# EAGLE design R2D2 Remote (EAGLE 9.5.2)
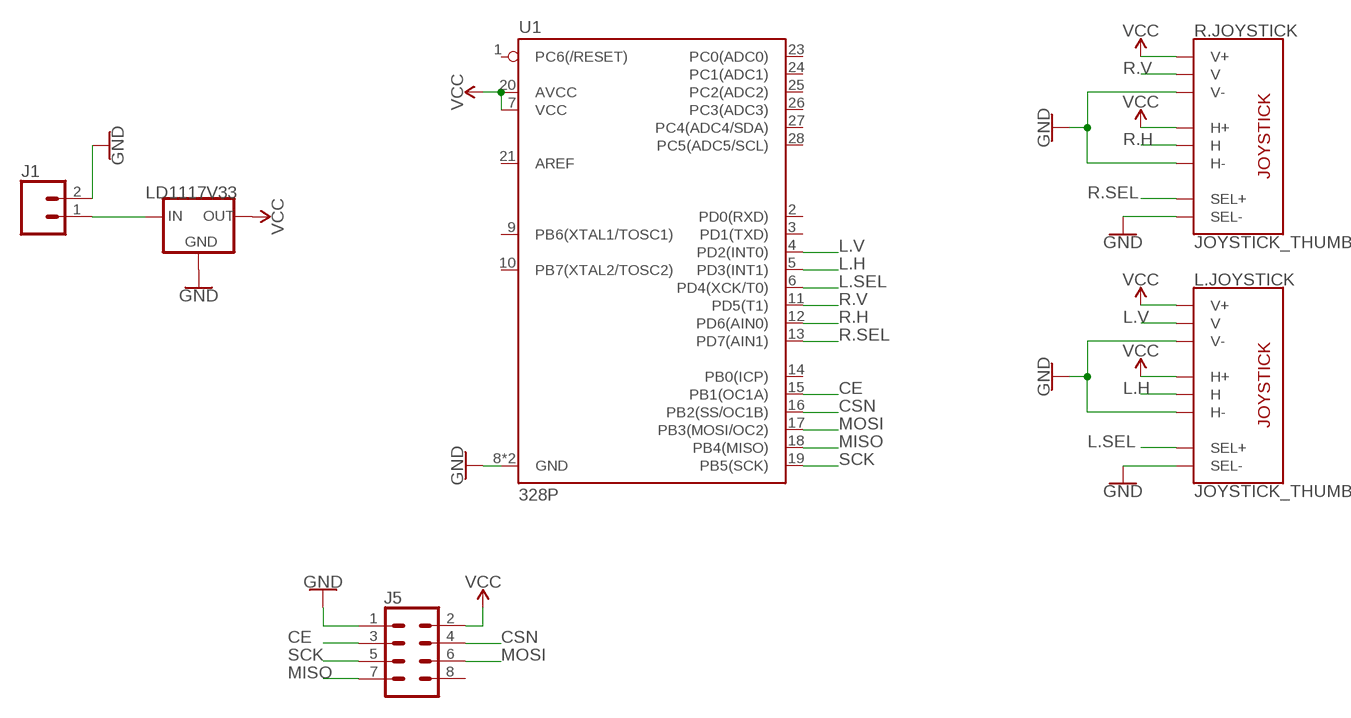
[diagram p0: schematic, sheet 1]

## Parts
J1  CONN_02  [1X02]
J5  CONN_04X2  [2X4]
L.JOYSTICK  JOYSTICK_THUMB  [JOYSTICK]
R.JOYSTICK  JOYSTICK_THUMB  [JOYSTICK]
U1  328P  ATMEGA328P_PDIP  [DIP28]
U$1  LD1117V33  V_REG_LD1117VXX  [78XXL]

## Nets
CE: J5.3 U1.15(PB1(OC1A))
CSN: J5.4 U1.16(PB2(SS/OC1B))
GND: J1.2 J5.1 L.JOYSTICK.B2A(SEL-) L.JOYSTICK.H3(H-) L.JOYSTICK.V3(V-) R.JOYSTICK.B2A(SEL-) R.JOYSTICK.H3(H-) R.JOYSTICK.V3(V-) U1.8(GND) U1.22(GND) U$1.IN(GND)
L.H: L.JOYSTICK.H2(H) U1.5(PD3(INT1))
L.SEL: L.JOYSTICK.B1A(SEL+) U1.6(PD4(XCK/T0))
L.V: L.JOYSTICK.V2(V) U1.4(PD2(INT0))
MISO: J5.7 U1.18(PB4(MISO))
MOSI: J5.6 U1.17(PB3(MOSI/OC2))
N$1: J1.1 U$1.OUT(IN)
R.H: R.JOYSTICK.H2(H) U1.12(PD6(AIN0))
R.SEL: R.JOYSTICK.B1A(SEL+) U1.13(PD7(AIN1))
R.V: R.JOYSTICK.V2(V) U1.11(PD5(T1))
SCK: J5.5 U1.19(PB5(SCK))
VCC: J5.2 L.JOYSTICK.H1(H+) L.JOYSTICK.V1(V+) R.JOYSTICK.H1(H+) R.JOYSTICK.V1(V+) U1.7(VCC) U1.20(AVCC) U$1.GND(OUT)
Unconnected: J5.8 U1.1(PC6(/RESET)) U1.2(PD0(RXD)) U1.3(PD1(TXD)) U1.9(PB6(XTAL1/TOSC1)) U1.10(PB7(XTAL2/TOSC2)) U1.14(PB0(ICP)) U1.21(AREF) U1.23(PC0(ADC0)) U1.24(PC1(ADC1)) U1.25(PC2(ADC2)) U1.26(PC3(ADC3)) U1.27(PC4(ADC4/SDA)) U1.28(PC5(ADC5/SCL))

## Library data of the parts
J1 = SparkFun-Connectors:CONN_02: Multi connection point. Often used as Generic Header-pin footprint for 0.1 inch spaced/style header connections On any of the 0.1 inch spaced packages, you can populate with these: Break Away Headers - Straight <https://www.sparkfun.com/products/116> (PRT-00116) Break Away Male Headers - Right Angle <https://www.sparkfun.com/products/553> (PRT-00553) Female Headers <https://www.sparkfun.com/products/115> (PRT-00115) Break Away Headers - Machine Pin <https://www.sparkfun.com/products/117> (PRT-00117) Break Away Female Headers - Swiss Machine Pin <https://www.sparkfun.com/products/743> (PRT-00743) For SCREWTERMINALS and SPRING TERMINALS visit here: Screw Terimnals on SparkFun.com <https://www.sparkfun.com/search/results?term=Screw+Terminals> (5mm/3.5mm/2.54mm spacing) This device is also useful as a general connection point to wire up your design to another part of your project. Our various solder wires solder well into these plated through hole pads. Hook-Up Wire - Assortment (Stranded, 22 AWG) <https://www.sparkfun.com/products/11375> (PRT-11375) Hook-Up Wire - Assortment (Solid Core, 22 AWG) <https://www.sparkfun.com/products/11367> (PRT-11367) View the entire wire category on our website here <https://www.sparkfun.com/categories/141> Special notes: Molex polarized connector foot print use with: PRT-08233 with associated crimp pins and housings. 2.54_SCREWTERM for use with PRT-10571. 3.5mm Screw Terminal footprints for PRT-08084 5mm Screw Terminal footprints for use with PRT-08432
J5 = SparkFun-Connectors:CONN_04X2: Multi connection point. Often used as Generic Header-pin footprint for 0.1 inch spaced/style header connections On any of the 0.1 inch spaced packages, you can populate with these: Break Away Headers - Straight <https://www.sparkfun.com/products/116> (PRT-00116) Break Away Male Headers - Right Angle <https://www.sparkfun.com/products/553> (PRT-00553) Female Headers <https://www.sparkfun.com/products/115> (PRT-00115) Break Away Headers - Machine Pin <https://www.sparkfun.com/products/117> (PRT-00117) Break Away Female Headers - Swiss Machine Pin <https://www.sparkfun.com/products/743> (PRT-00743)
L.JOYSTICK R.JOYSTICK = SparkFun-Switches:JOYSTICK_THUMB: Analog Thumb Joystick This is a joystick very similar to the ‘analog’ joysticks on PS2 (PlayStation 2) controllers. Directional movements are simply two potentiometers - one for each axis. Pots are ~10k each. This joystick also has a select button that is actuated when the joystick is pressed down. SparkFun Products Thumb Joystick <https://www.sparkfun.com/products/9032> (COM-09032) SparkFun Thumb Joystick Breakout <https://www.sparkfun.com/products/9110> (BOB-09110) SparkFun Joystick Shield Kit <https://www.sparkfun.com/products/9760> (DEV-09760); PROD_ID: COMP-09744; SF_SKU: COM-09032
U1 = SparkFun-IC-Microcontroller:ATMEGA328P_PDIP: Atmel 328P Through hole ATMEGA328P uC used in the Arduino 32kb flash, 1k EEPROM, 2k SRAM Datasheet <http://www.sparkfun.com/datasheets/Components/SMD/ATMega328.pdf> SparkFun Products Storefront component: AVR 28 Pin 20MHz 32K 6A/D - ATMega328P <https://www.sparkfun.com/products/9061> (COM-09061) SparkFun Simon Says - Through-Hole Soldering Kit <https://www.sparkfun.com/products/10547> (KIT-10547) SparkFun Learn to Solder - Simon Says <https://www.sparkfun.com/products/13708> (KIT-13708) SparkFun BigTime Watch Kit <https://www.sparkfun.com/products/11734> (KIT-11734) SparkFun ClockIt <https://www.sparkfun.com/products/10930> (KIT-10930) SparkFun Serial Enabled LCD Kit <https://www.sparkfun.com/products/10097> (LCD-10097) SparkFun Simon Tilts - Through Hole Soldering Kit <https://www.sparkfun.com/products/12634> (KIT-12634) SparkFun Frequency Counter Kit <https://www.sparkfun.com/products/10140> (KIT-10140) FabFM Radio Kit <https://www.sparkfun.com/products/11043> (KIT-11043) SparkFun Binary Blaster Kit <https://www.sparkfun.com/products/12037> (KIT-12037) SparkFun Metro-Gnome <https://www.sparkfun.com/products/9236> (KIT-09236) ATmega328 with Arduino Optiboot (Uno) <https://www.sparkfun.com/products/10524> (DEV-10524); PROD_ID: IC-09136
U$1 = SparkFun-IC-Power:V_REG_LD1117VXX: LD1117VXX voltage regulator. We carry the 3.3V version (COM-00526) in TO-220 package.

## Board
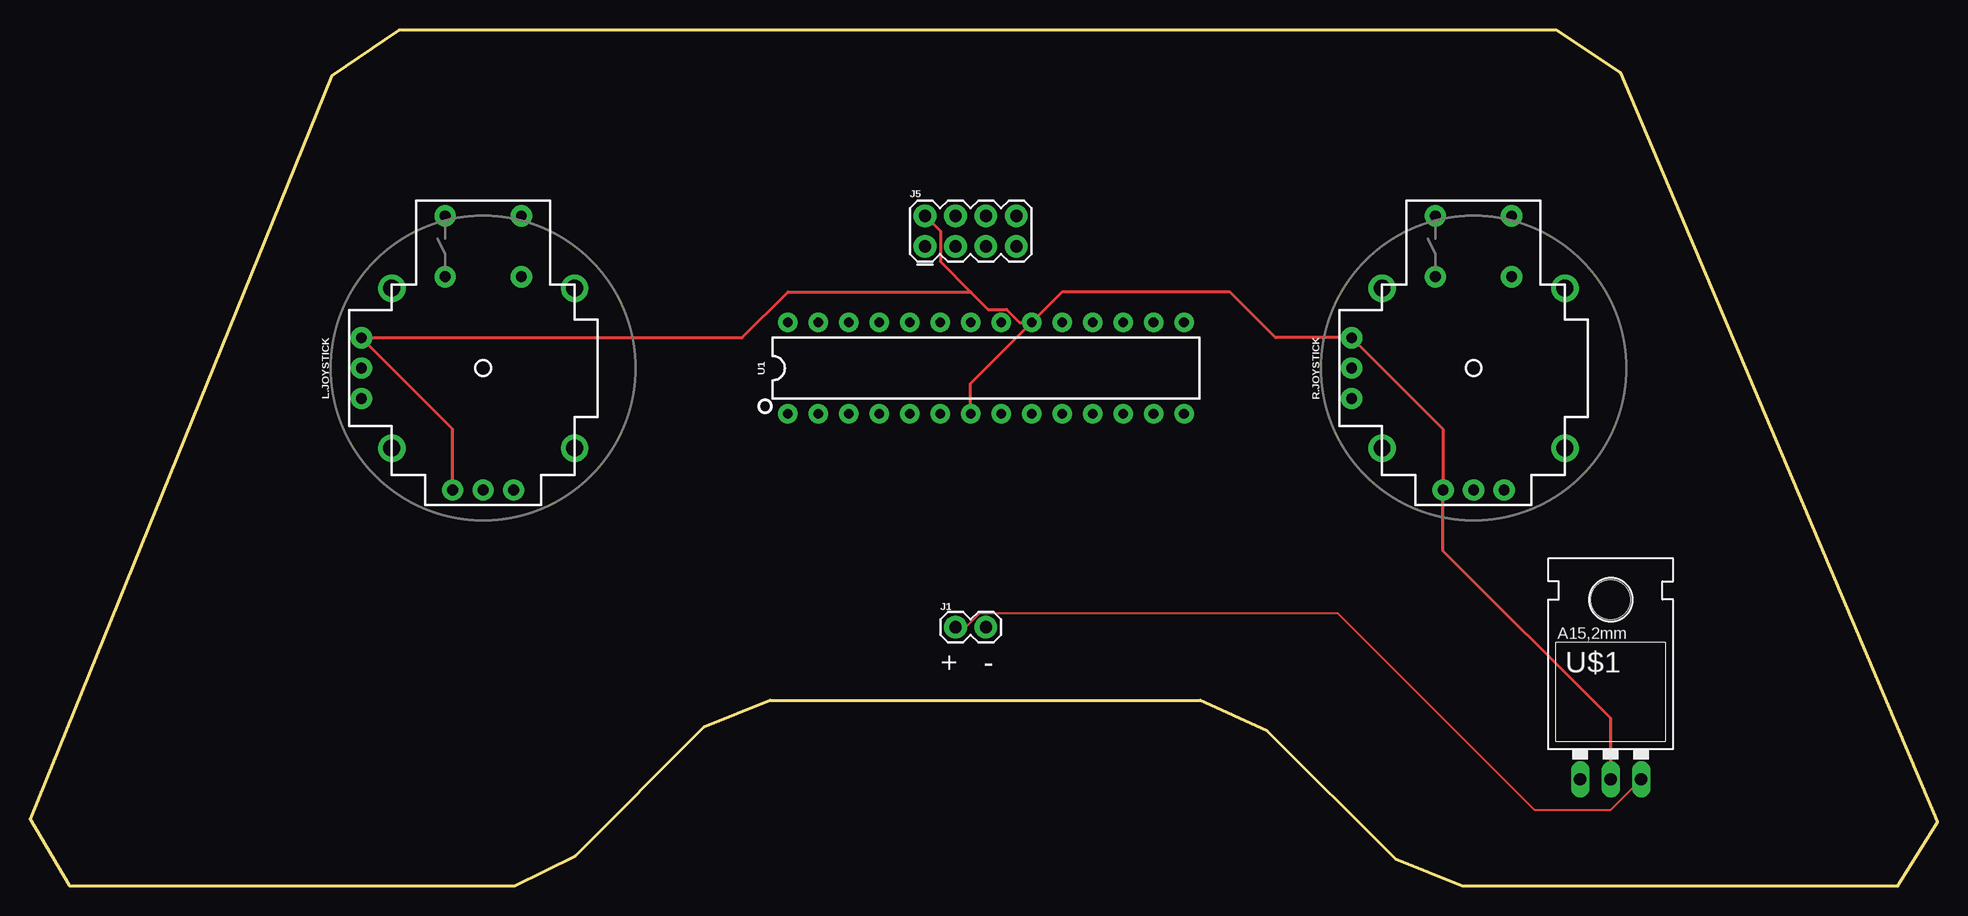
[diagram p1: board, top side]
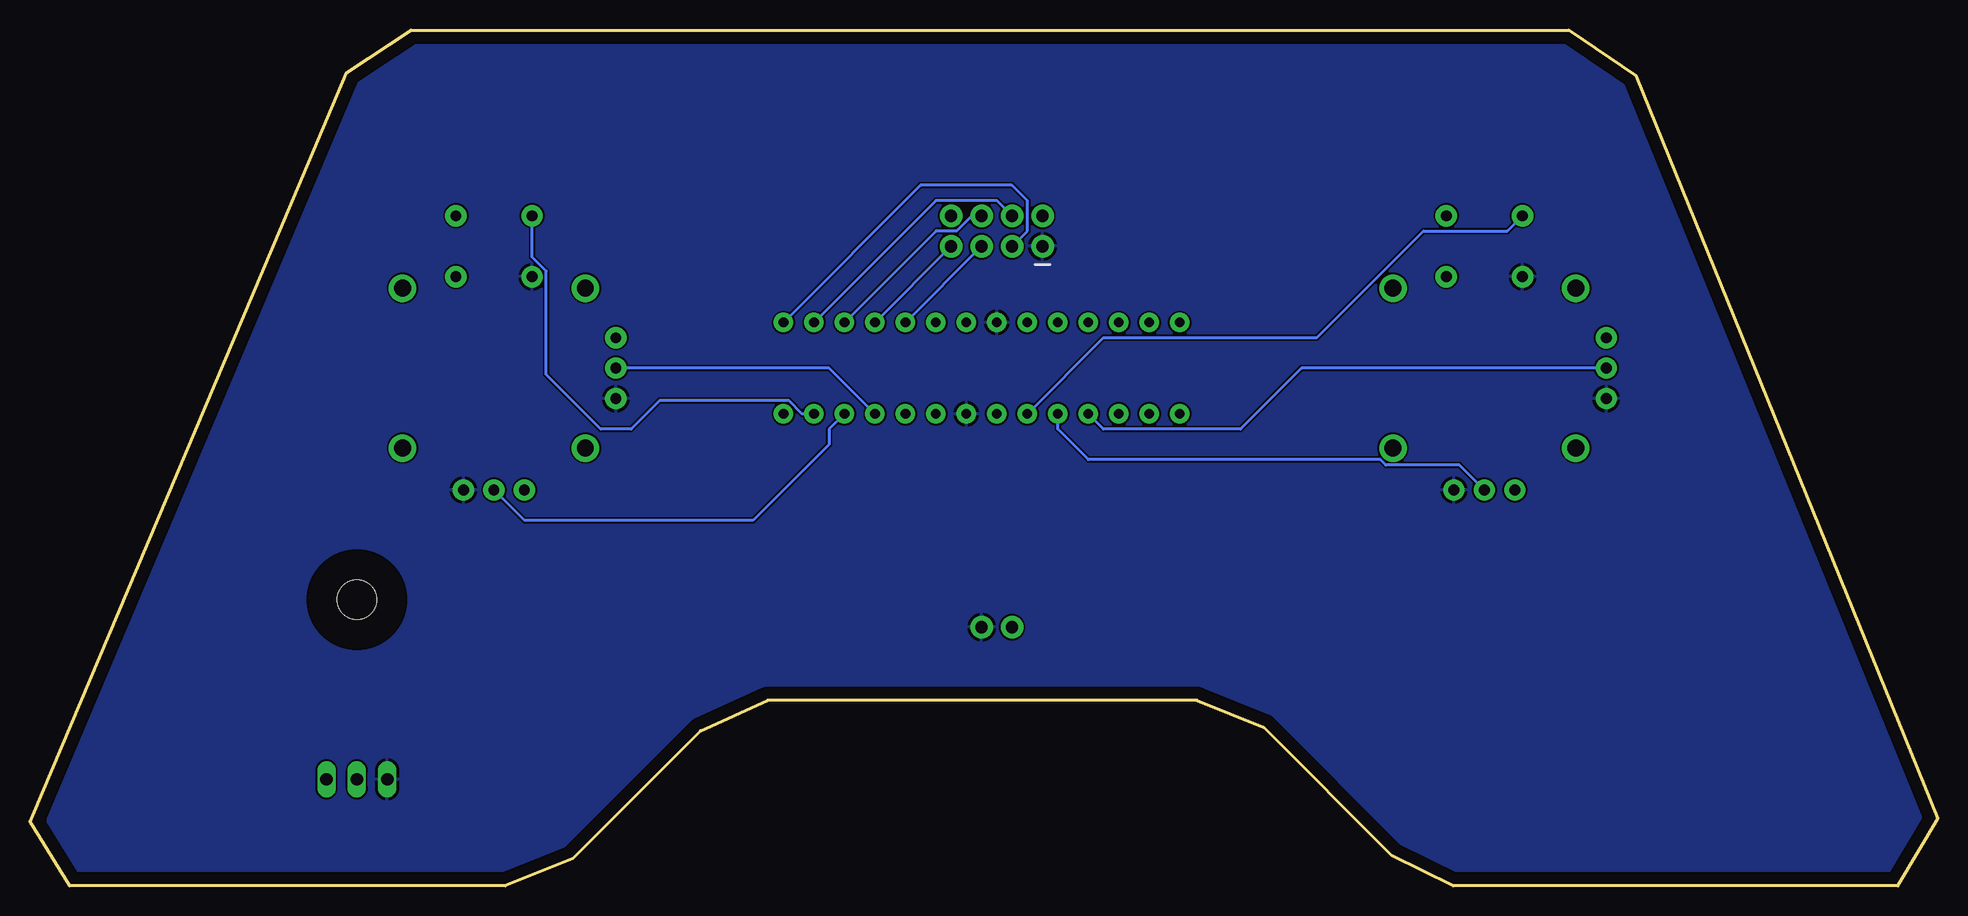
[diagram p2: board, bottom side, seen from below]

Size 159 x 71.37 mm. Coordinates in mm from the lower left corner, seen from the top.
Outline: 3.3,0 40.39,0 45.47,2.54 56.13,13.21 61.72,15.49 97.54,15.49 103.12,12.95 113.79,2.29 119.38,0 155.7,0 159,5.33 132.59,67.82 127.25,71.37 30.73,71.37 25.15,67.56 0,5.59 3.3,0
Copper layers (1*16): Top 0.035mm / dielectric 1.5mm / Bottom 0.035mm
Design rules "default": minimum track width 6mil, minimum drill 0.35mm, track to track 6mil, track to pad 6mil, pad to pad 6mil, via to via 6mil, smd to smd 6mil, copper to edge 40mil, drill to drill 6mil, minimum pad ring 10mil, minimum via ring 8mil, stop-mask expansion 4mil, vias tented up to drill 0mil, thermal gap 10mil

### Footprints (pad centres in the part's own frame; a part is rotated, then mirrored left to right if it is on the bottom)
1X02 = drill 1.016 pad 1.88: 1 0,0; 2 2.54,0
2X4 = drill 1.016 pad 1.88: 1 -3.81,-1.27; 2 -3.81,1.27; 3 -1.27,-1.27; 4 -1.27,1.27; 5 1.27,-1.27; 6 1.27,1.27; 7 3.81,-1.27; 8 3.81,1.27
JOYSTICK = drill 0.9 pad 1.778: B1A -3.175,12.7; B1B 3.175,12.7; B2A -3.175,7.62; B2B 3.175,7.62 | drill 0.889 pad 1.778: H1 -2.54,-10.16; H2 0,-10.16; H3 2.54,-10.16; V1 -10.16,2.54; V2 -10.16,0; V3 -10.16,-2.54 | drill 1.397 pad 2.286: MOUNT1 -7.62,6.668; MOUNT2 -7.62,-6.668; MOUNT3 7.62,-6.668; MOUNT4 7.62,6.668
DIP28 = drill 0.813 pad 1.626: 1 -16.51,-3.81; 2 -13.97,-3.81; 3 -11.43,-3.81; 4 -8.89,-3.81; 5 -6.35,-3.81; 6 -3.81,-3.81; 7 -1.27,-3.81; 8 1.27,-3.81; 9 3.81,-3.81; 10 6.35,-3.81; 11 8.89,-3.81; 12 11.43,-3.81; 13 13.97,-3.81; 14 16.51,-3.81; 15 16.51,3.81; 16 13.97,3.81; 17 11.43,3.81; 18 8.89,3.81; 19 6.35,3.81; 20 3.81,3.81; 21 1.27,3.81; 22 -1.27,3.81; 23 -3.81,3.81; 24 -6.35,3.81; 25 -8.89,3.81; 26 -11.43,3.81; 27 -13.97,3.81; 28 -16.51,3.81
78XXL = drill 1.016 long: GND 0,-3.81; IN -2.54,-3.81; OUT 2.54,-3.81 | hole 3.302: 0,11.176

### Placement (x,y rotation side)
J1  77.14,21.59 0 top
J5  78.41,54.61 0 top
L.JOYSTICK  37.77,43.18 0 top
R.JOYSTICK  120.33,43.18 0 top
U1  79.69,43.18 0 top
U$1  131.76,12.7 0 top

### Tracks (layer width: path | path; a pad name or v marks a point on that pad's centre or on a via)
CE
  Bottom 0.254: J5.3 75.88,54.61 75.88,57.15 77.14,58.42 84.77,58.42 U1.15
CSN
  Bottom 0.254: J5.4 78.41,57.15 83.49,57.15 U1.16
GND
  pour Bottom: -5.41,80.01 159.7,80.01 159.7,-2.54 -5.41,-2.54
L.H
  Bottom 0.254: L.JOYSTICK.H2 39.84,35.09 45.98,35.09 46.45,35.56 70.8,35.56 73.33,38.1 U1.5
L.SEL
  Bottom 0.254: U1.6 69.52,45.72 51.74,45.72 42.85,54.61 35.87,54.61 L.JOYSTICK.B1A
L.V
  Bottom 0.254: L.JOYSTICK.V2 53.02,43.18 58.09,38.1 69.52,38.1 U1.4
MISO
  Bottom 0.254: U1.18 J5.7
MOSI
  Bottom 0.254: J5.6 80.5,55.88 81.72,54.66 83.44,54.66 U1.17
N$1
  Top 0.152: J1.1 78.03,21.59 79.2,22.76 109,22.76 125.41,6.35 131.76,6.35 U$1.OUT
R.H
  Bottom 0.254: U1.12 92.38,38.1 92.38,36.83 98.73,30.48 117.78,30.48 R.JOYSTICK.H2
R.SEL
  Bottom 0.254: U1.13 94.65,39.37 95.74,40.46 106.53,40.46 108.89,38.1 111.44,38.1 115.98,42.65 115.98,51.28 117.15,52.45 R.JOYSTICK.B1A
R.V
  Bottom 0.254: U1.11 92.38,43.18 R.JOYSTICK.V2
SCK
  Bottom 0.254: U1.19 J5.5
VCC
  Top 0.254: U$1.GND 131.76,13.97 117.78,27.94 R.JOYSTICK.H1 117.78,38.1 R.JOYSTICK.V1 103.81,45.72 100,49.53 86.03,49.53 U1.20 | J5.2 75.88,54.61 75.88,52.07 78.41,49.53 | 78.41,49.53 79.86,48.08 81.41,48.08 82.5,46.99 U1.20 | U1.7 78.41,41.91 U1.20 | L.JOYSTICK.H1 35.23,38.1 L.JOYSTICK.V1 59.36,45.72 63.17,49.53 78.41,49.53

### Text on the board
tNames: + -